# EAGLE design EEPROM_Programmer (EAGLE 9.5.2)
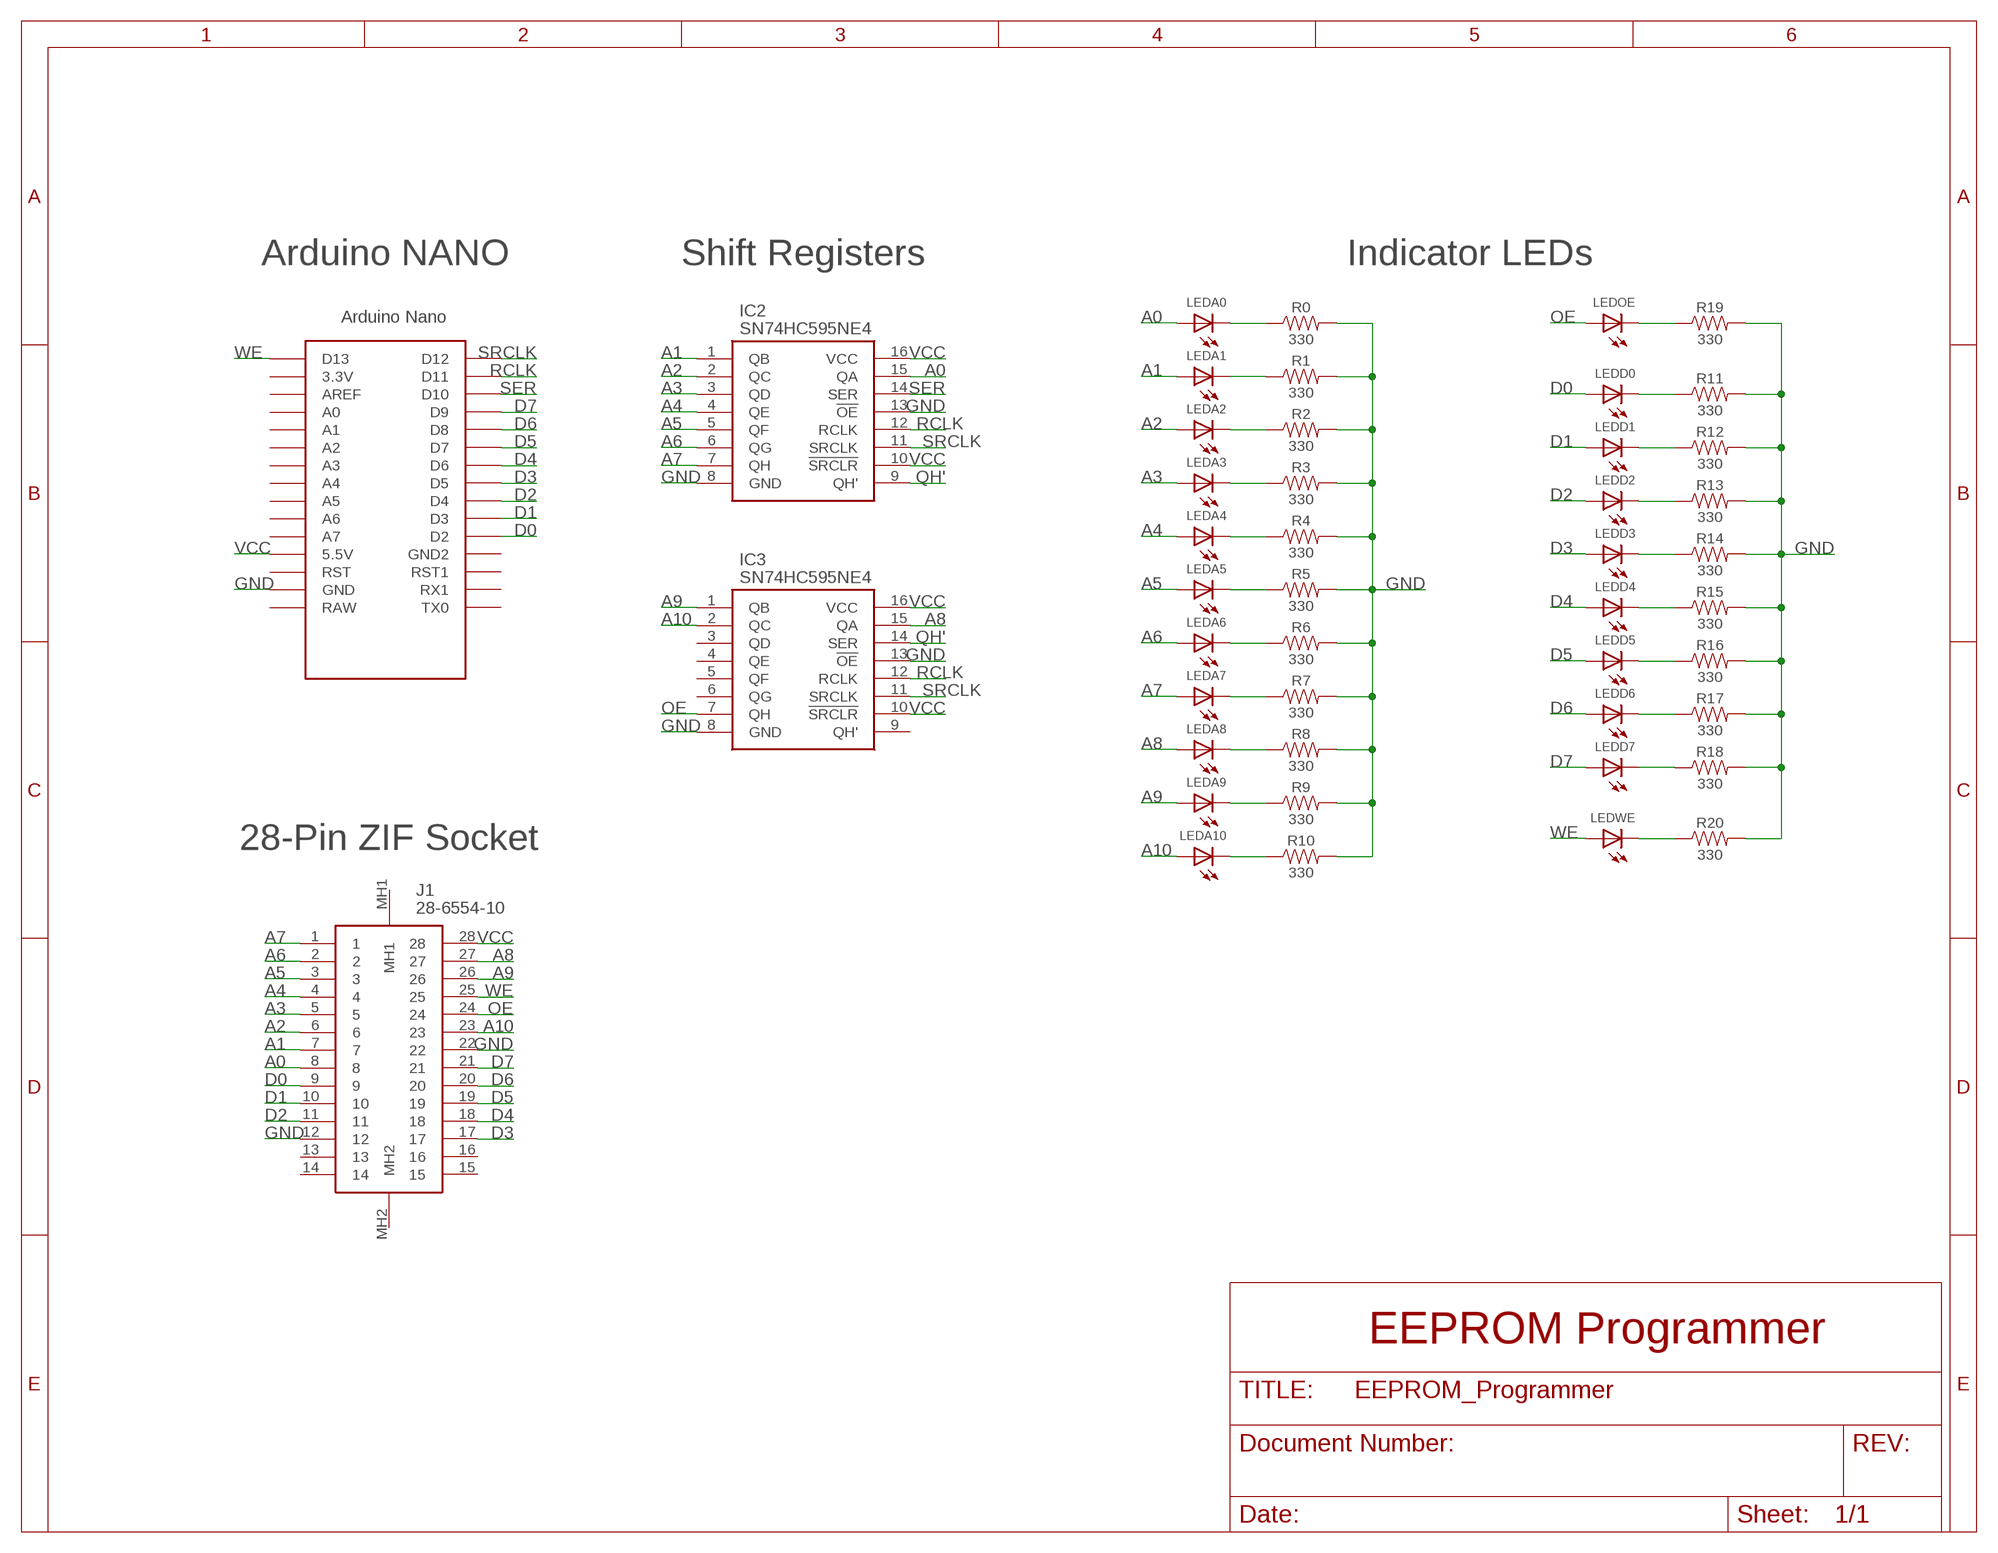
[diagram p0: schematic, sheet 1]

## Parts
IC2  SN74HC595NE4  [DIP794W53P254L1930H508Q16N]
IC3  SN74HC595NE4  [DIP794W53P254L1930H508Q16N]
J1  28-6554-10  [28655410]
LEDA0  LEDCHIPLED_1206  [CHIPLED_1206]
LEDA1  LEDCHIPLED_1206  [CHIPLED_1206]
LEDA2  LEDCHIPLED_1206  [CHIPLED_1206]
LEDA3  LEDCHIPLED_1206  [CHIPLED_1206]
LEDA4  LEDCHIPLED_1206  [CHIPLED_1206]
LEDA5  LEDCHIPLED_1206  [CHIPLED_1206]
LEDA6  LEDCHIPLED_1206  [CHIPLED_1206]
LEDA7  LEDCHIPLED_1206  [CHIPLED_1206]
LEDA8  LEDCHIPLED_1206  [CHIPLED_1206]
LEDA9  LEDCHIPLED_1206  [CHIPLED_1206]
LEDA10  LEDCHIPLED_1206  [CHIPLED_1206]
LEDD0  LEDCHIPLED_1206  [CHIPLED_1206]
LEDD1  LEDCHIPLED_1206  [CHIPLED_1206]
LEDD2  LEDCHIPLED_1206  [CHIPLED_1206]
LEDD3  LEDCHIPLED_1206  [CHIPLED_1206]
LEDD4  LEDCHIPLED_1206  [CHIPLED_1206]
LEDD5  LEDCHIPLED_1206  [CHIPLED_1206]
LEDD6  LEDCHIPLED_1206  [CHIPLED_1206]
LEDD7  LEDCHIPLED_1206  [CHIPLED_1206]
LEDOE  LEDCHIPLED_1206  [CHIPLED_1206]
LEDWE  LEDCHIPLED_1206  [CHIPLED_1206]
R0  330  RESISTOR1206  [1206]
R1  330  RESISTOR1206  [1206]
R2  330  RESISTOR1206  [1206]
R3  330  RESISTOR1206  [1206]
R4  330  RESISTOR1206  [1206]
R5  330  RESISTOR1206  [1206]
R6  330  RESISTOR1206  [1206]
R7  330  RESISTOR1206  [1206]
R8  330  RESISTOR1206  [1206]
R9  330  RESISTOR1206  [1206]
R10  330  RESISTOR1206  [1206]
R11  330  RESISTOR1206  [1206]
R12  330  RESISTOR1206  [1206]
R13  330  RESISTOR1206  [1206]
R14  330  RESISTOR1206  [1206]
R15  330  RESISTOR1206  [1206]
R16  330  RESISTOR1206  [1206]
R17  330  RESISTOR1206  [1206]
R18  330  RESISTOR1206  [1206]
R19  330  RESISTOR1206  [1206]
R20  330  RESISTOR1206  [1206]
U$1  NANO  [NANO]

## Nets
A0: IC2.15(QA) J1.8 LEDA0.A
A1: IC2.1(QB) J1.7 LEDA1.A
A2: IC2.2(QC) J1.6 LEDA2.A
A3: IC2.3(QD) J1.5 LEDA3.A
A4: IC2.4(QE) J1.4 LEDA4.A
A5: IC2.5(QF) J1.3 LEDA5.A
A6: IC2.6(QG) J1.2 LEDA6.A
A7: IC2.7(QH) J1.1 LEDA7.A
A8: IC3.15(QA) J1.27 LEDA8.A
A9: IC3.1(QB) J1.26 LEDA9.A
A10: IC3.2(QC) J1.23 LEDA10.A
D0: J1.9 LEDD0.A U$1.D2
D1: J1.10 LEDD1.A U$1.D3
D2: J1.11 LEDD2.A U$1.D4
D3: J1.17 LEDD3.A U$1.D5
D4: J1.18 LEDD4.A U$1.D6
D5: J1.19 LEDD5.A U$1.D7
D6: J1.20 LEDD6.A U$1.D8
D7: J1.21 LEDD7.A U$1.D9
GND: IC2.8(GND) IC2.13(!OE) IC3.8(GND) IC3.13(!OE) J1.12 J1.22 R0.2 R1.2 R2.2 R3.2 R4.2 R5.2 R6.2 R7.2 R8.2 R9.2 R10.2 R11.2 R12.2 R13.2 R14.2 R15.2 R16.2 R17.2 R18.2 R19.2 R20.2 U$1.GND
N$1: LEDA0.C R0.1
N$2: LEDA2.C R2.1
N$3: LEDA3.C R3.1
N$4: LEDA4.C R4.1
N$5: LEDA5.C R5.1
N$6: LEDA6.C R6.1
N$7: LEDA7.C R7.1
N$8: LEDA8.C R8.1
N$9: LEDA9.C R9.1
N$10: LEDA10.C R10.1
N$11: LEDA1.C R1.1
N$12: LEDD0.C R11.1
N$13: LEDD1.C R12.1
N$14: LEDD2.C R13.1
N$15: LEDD3.C R14.1
N$16: LEDD4.C R15.1
N$17: LEDD5.C R16.1
N$18: LEDD6.C R17.1
N$19: LEDD7.C R18.1
N$20: LEDOE.C R19.1
N$21: LEDWE.C R20.1
OE: IC3.7(QH) J1.24 LEDOE.A
QH': IC2.9(QH') IC3.14(SER)
RCLK: IC2.12(RCLK) IC3.12(RCLK) U$1.D11
SER: IC2.14(SER) U$1.D10
SRCLK: IC2.11(SRCLK) IC3.11(SRCLK) U$1.D12
VCC: IC2.10(!SRCLR) IC2.16(VCC) IC3.10(!SRCLR) IC3.16(VCC) J1.28 U$1.5V(5.5V)
WE: J1.25 LEDWE.A U$1.D13
Unconnected: IC3.3(QD) IC3.4(QE) IC3.5(QF) IC3.6(QG) IC3.9(QH') J1.13 J1.14 J1.15 J1.16 J1.MH1 J1.MH2 U$1.3.3V U$1.A0 U$1.A1 U$1.A2 U$1.A3 U$1.A4 U$1.A5 U$1.A6 U$1.A7 U$1.AREF U$1.GND1(GND2) U$1.RAW U$1.RST U$1.RST1 U$1.RX1 U$1.TX0

## Notes on the sheet
- Arduino NANO | Shift Registers | Indicator LEDs
- 28-Pin ZIF Socket

## Library data of the parts
IC2 IC3 = !EEPROM_Programmer:SN74HC595NE4: Counter Shift Registers 8-Bit Shift Register Source: Datasheet <http://www.ti.com/lit/ds/symlink/sn74hc595.pdf>; DESCRIPTION: Counter Shift Registers 8-Bit Shift Register; HEIGHT: 5.08mm; MANUFACTURER_NAME: Texas Instruments; MANUFACTURER_PART_NUMBER: SN74HC595NE4; MOUSER_PART_NUMBER: 595-SN74HC595NE4; MOUSER_PRICE-STOCK: https://www.mouser.com/Search/Refine.aspx?Keyword=595-SN74HC595NE4
J1 = !EEPROM_Programmer:28-6554-10: Aries Electronics 2.54mm Pitch 28 Way Through Hole Universal ZIF Test Socket Source: Datasheet <https://componentsearchengine.com/Datasheets/1/28-6554-10.pdf>; DESCRIPTION: Aries Electronics 2.54mm Pitch 28 Way Through Hole Universal ZIF Test Socket; HEIGHT: 11.94mm; MANUFACTURER_NAME: ARIES; MANUFACTURER_PART_NUMBER: 28-6554-10; MOUSER_PART_NUMBER: 535-28-6554-10; MOUSER_PRICE-STOCK: https://www.mouser.com/Search/Refine.aspx?Keyword=535-28-6554-10; RS_PART_NUMBER: 0403825; RS_PRICE-STOCK: http://uk.rs-online.com/web/p/products/0403825
LEDA0 LEDA1-LEDA10 LEDD0 LEDD1-LEDD7 LEDOE LEDWE = adafruit:LED: LED OSRAM: - CHIPLED LG R971, LG N971, LY N971, LG Q971, LY Q971, LO R971, LY R971 LH N974, LH R974 LS Q976, LO Q976, LY Q976 LO Q996 - Hyper CHIPLED LW Q18S LB Q993, LB Q99A, LB R99A - SideLED LS A670, LO A670, LY A670, LG A670, LP A670 LB A673, LV A673, LT A673, LW A673 LH A674 LY A675 LS A676, LA A676, LO A676, LY A676, LW A676 LS A679, LY A679, LG A679 - Hyper Micro SIDELED® LS Y876, LA Y876, LO Y876, LY Y876 LT Y87S - SmartLED LW L88C, LW L88S LB L89C, LB L89S, LG L890 LS L89K, LO L89K, LY L89K LS L896, LA L896, LO L896, LY L896 - TOPLED LS T670, LO T670, LY T670, LG T670, LP T670 LSG T670, LSP T670, LSY T670, LOP T670, LYG T670 LG T671, LOG T671, LSG T671 LB T673, LV T673, LT T673, LW T673 LH T674 LS T676, LA T676, LO T676, LY T676, LB T676, LH T676, LSB T676, LW T676 LB T67C, LV T67C, LT T67C, LS T67K, LO T67K, LY T67K, LW E67C LS E67B, LA E67B, LO E67B, LY E67B, LB E67C, LV E67C, LT E67C LW T67C LS T679, LY T679, LG T679 LS T770, LO T770, LY T770, LG T770, LP T770 LB T773, LV T773, LT T773, LW T773 LH T774 LS E675, LA E675, LY E675, LS T675 LS T776, LA T776, LO T776, LY T776, LB T776 LHGB T686 LT T68C, LB T68C - Hyper Mini TOPLED® LB M676 - Mini TOPLED Santana® LG M470 LS M47K, LO M47K, LY M47K Source: http://www.osram.convergy.de/
R0 R1-R20 = SparkFun-Resistors:RESISTOR: Generic Resistor Package
U$1 = !EEPROM_Programmer:NANO: Arduino Nano

## Board
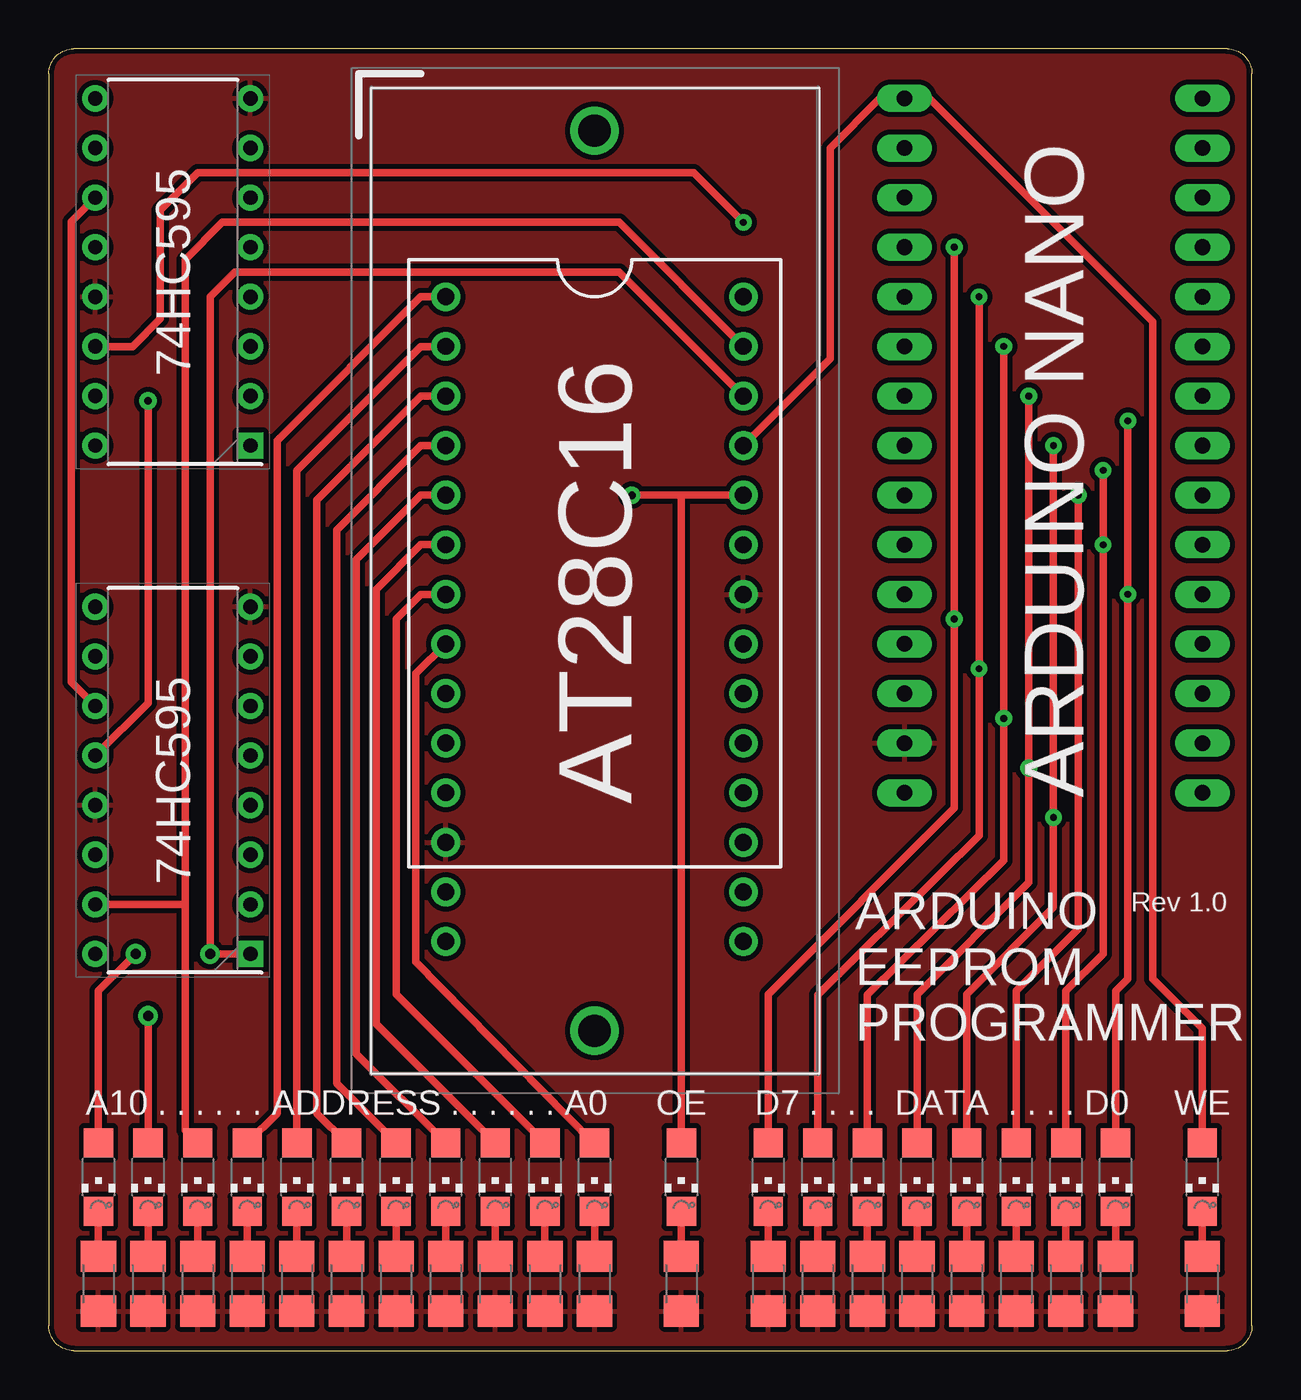
[diagram p1: board, top side]
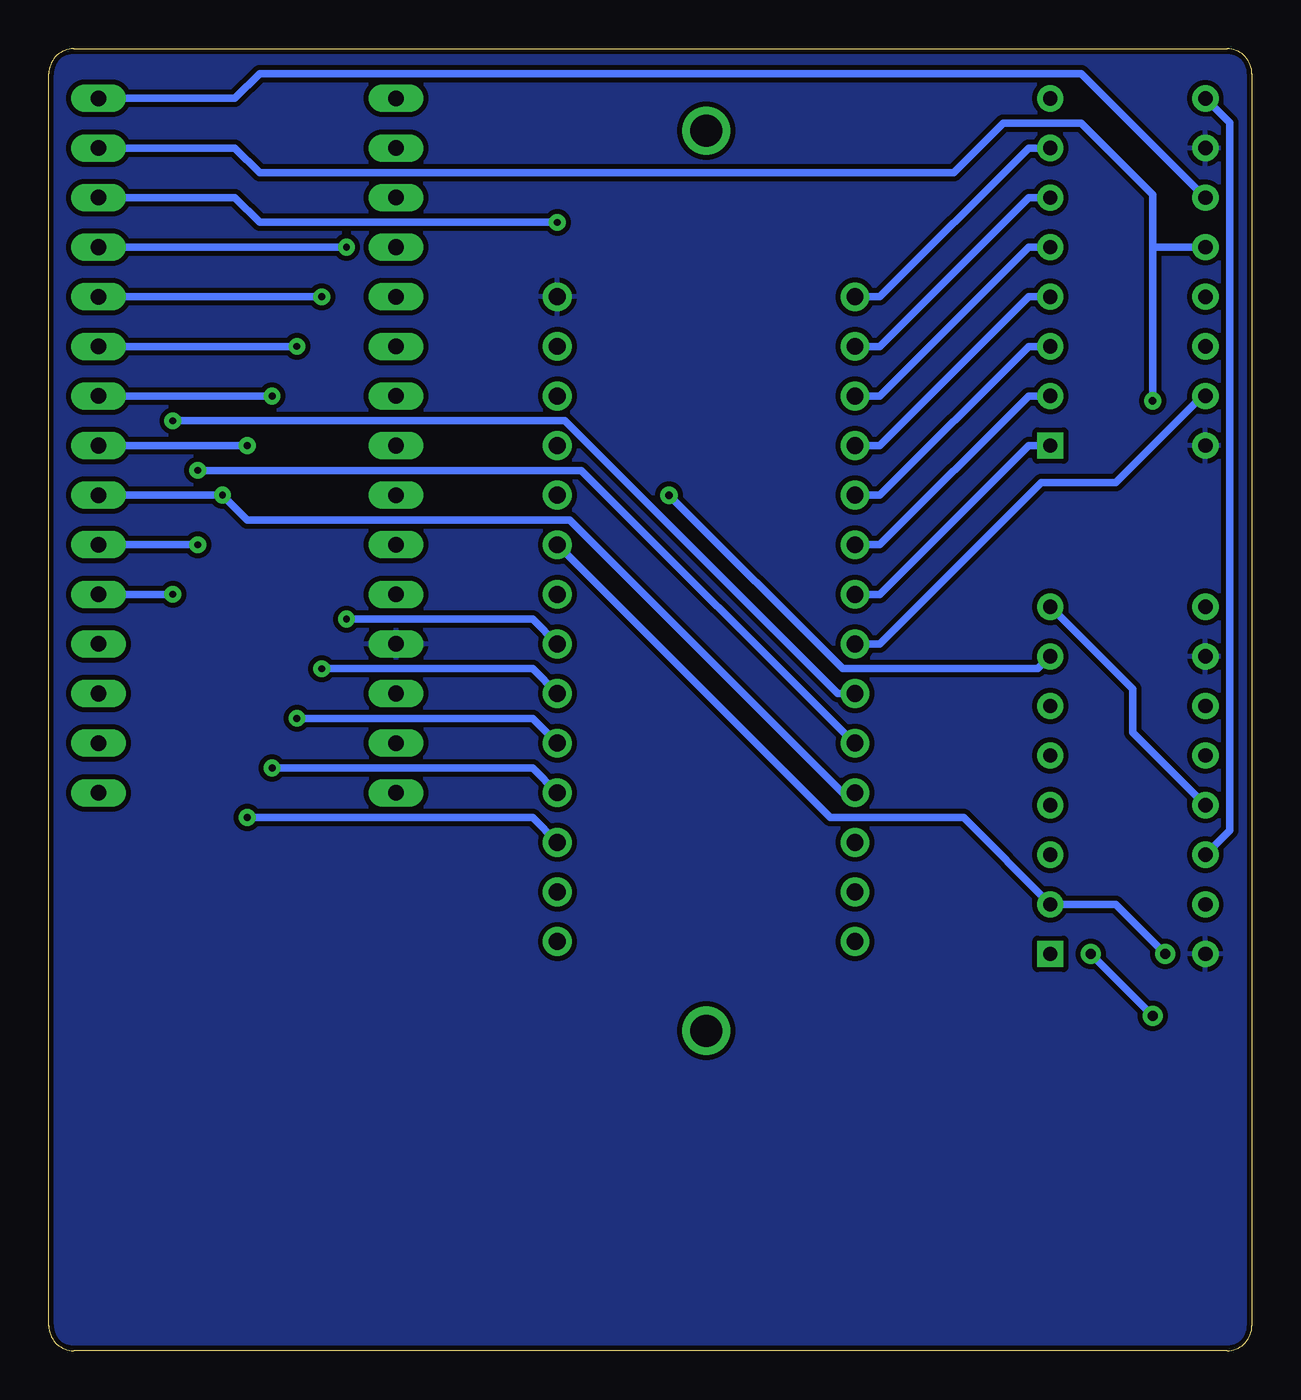
[diagram p2: board, bottom side, seen from below]

Size 61.59 x 66.67 mm. Coordinates in mm from the lower left corner, seen from the top.
Outline: 60.33,66.67 1.27,66.67 arc90 0,65.41 0,1.27 arc90 1.27,0 60.33,0 arc90 61.59,1.27 61.59,65.41 arc90 60.33,66.67
Copper layers (1*16): Top 0.035mm / dielectric 1.5mm / Bottom 0.035mm
Design rules "SparkFun": minimum track width 8mil, minimum drill 10mil, track to track 8mil, track to pad 8mil, pad to pad 8mil, via to via 8mil, smd to smd 8mil, copper to edge 8mil, drill to drill 8mil, minimum pad ring 12mil, minimum via ring 10mil, stop-mask expansion 4mil, vias tented up to drill 20mil, thermal gap 10mil

### Footprints (pad centres in the part's own frame; a part is rotated, then mirrored left to right if it is on the bottom)
DIP794W53P254L1930H508Q16N = drill 0.73 pad 1.13 square: 1 -3.97,8.89 | drill 0.73 pad 1.13: 2 -3.97,6.35; 3 -3.97,3.81; 4 -3.97,1.27; 5 -3.97,-1.27; 6 -3.97,-3.81; 7 -3.97,-6.35; 8 -3.97,-8.89; 9 3.97,-8.89; 10 3.97,-6.35; 11 3.97,-3.81; 12 3.97,-1.27; 13 3.97,1.27; 14 3.97,3.81; 15 3.97,6.35; 16 3.97,8.89
28655410 = drill 0.864 pad 1.404: 1 0,0; 2 2.54,0; 3 5.08,0; 4 7.62,0; 5 10.16,0; 6 12.7,0; 7 15.24,0; 8 17.78,0; 9 20.32,0; 10 22.86,0; 11 25.4,0; 12 27.94,0; 13 30.48,0; 14 33.02,0; 15 33.02,15.24; 16 30.48,15.24; 17 27.94,15.24; 18 25.4,15.24; 19 22.86,15.24; 20 20.32,15.24; 21 17.78,15.24; 22 15.24,15.24; 23 12.7,15.24; 24 10.16,15.24; 25 7.62,15.24; 26 5.08,15.24; 27 2.54,15.24; 28 0,15.24 | drill 1.65 pad 2.475: MH1 -8.51,7.62; MH2 37.59,7.62
CHIPLED_1206 = smd 1.5 x 1.5: A 0,-1.75; C 0,1.75
1206 = smd 1.6 x 1.8: 1 -1.4,0; 2 1.4,0
NANO = drill 0.8 long: 3.3V -10.16,24.13; 5V -10.16,-1.27; A0 -10.16,19.05; A1 -10.16,16.51; A2 -10.16,13.97; A3 -10.16,11.43; A4 -10.16,8.89; A5 -10.16,6.35; A6 -10.16,3.81; A7 -10.16,1.27; AREF -10.16,21.59; D2 5.08,1.27; D3 5.08,3.81; D4 5.08,6.35; D5 5.08,8.89; D6 5.08,11.43; D7 5.08,13.97; D8 5.08,16.51; D9 5.08,19.05; D10 5.08,21.59; D11 5.08,24.13; D12 5.08,26.67; D13 -10.16,26.67; GND -10.16,-6.35; GND1 5.08,-1.27; RAW -10.16,-8.89; RST -10.16,-3.81; RST1 5.08,-3.81; RX1 5.08,-6.35; TX0 5.08,-8.89

### Placement (x,y rotation side)
IC2  6.35,55.24 180 top
IC3  6.35,29.21 180 top
J1  20.32,53.98 270 top
LEDA0  27.94,8.89 180 top
LEDA1  25.4,8.89 180 top
LEDA2  22.86,8.89 180 top
LEDA3  20.32,8.89 180 top
LEDA4  17.78,8.89 180 top
LEDA5  15.24,8.89 180 top
LEDA6  12.7,8.89 180 top
LEDA7  10.16,8.89 180 top
LEDA8  7.62,8.89 180 top
LEDA9  5.08,8.89 180 top
LEDA10  2.54,8.89 180 top
LEDD0  54.61,8.89 180 top
LEDD1  52.07,8.89 180 top
LEDD2  49.53,8.89 180 top
LEDD3  46.99,8.89 180 top
LEDD4  44.45,8.89 180 top
LEDD5  41.91,8.89 180 top
LEDD6  39.37,8.89 180 top
LEDD7  36.83,8.89 180 top
LEDOE  32.38,8.89 180 top
LEDWE  59.05,8.89 180 top
R0  27.94,3.43 270 top
R1  25.4,3.43 270 top
R2  22.86,3.43 270 top
R3  20.32,3.43 270 top
R4  17.78,3.43 270 top
R5  15.24,3.43 270 top
R6  12.7,3.43 270 top
R7  10.16,3.43 270 top
R8  7.62,3.43 270 top
R9  5.08,3.43 270 top
R10  2.54,3.43 270 top
R11  54.61,3.43 270 top
R12  52.07,3.43 270 top
R13  49.53,3.43 270 top
R14  46.99,3.43 270 top
R15  44.45,3.43 270 top
R16  41.91,3.43 270 top
R17  39.37,3.43 270 top
R18  36.83,3.43 270 top
R19  32.38,3.43 270 top
R20  59.05,3.43 270 top
U$1  53.98,37.47 0 top

### Tracks (layer width: path | path; a pad name or v marks a point on that pad's centre or on a via)
A0
  Top 0.381: LEDA0.A 27.87,10.64 18.8,19.91 18.8,34.67 J1.8
  Bottom 0.381: J1.8 19.05,36.2 10.79,44.45 6.99,44.45 2.54,48.9 IC2.15
A1
  Top 0.381: LEDA1.A 17.78,18.26 17.78,37.47 19.05,38.73 J1.7
  Bottom 0.381: IC2.1 11.43,46.35 19.05,38.73 J1.7
A2
  Top 0.381: J1.6 19.05,41.27 16.76,38.99 16.76,16.74 LEDA2.A
  Bottom 0.381: IC2.2 11.43,48.9 19.05,41.27 J1.6
A3
  Top 0.381: J1.5 19.05,43.81 15.75,40.51 15.75,15.21 LEDA3.A
  Bottom 0.381: IC2.3 11.43,51.44 19.05,43.81 J1.5
A4
  Top 0.381: J1.4 19.05,46.35 14.73,42.04 14.73,13.69 LEDA4.A
  Bottom 0.381: IC2.4 11.43,53.98 19.05,46.35 J1.4
A5
  Top 0.381: J1.3 19.05,48.9 13.72,43.56 13.72,12.16 LEDA5.A
  Bottom 0.381: IC2.5 11.43,56.52 19.05,48.9 J1.3
A6
  Top 0.381: LEDA6.A 12.7,45.09 19.05,51.44 J1.2
  Bottom 0.381: IC2.6 11.43,59.05 19.05,51.44 J1.2
A7
  Top 0.381: J1.1 19.05,53.98 11.68,46.61 11.68,12.16 LEDA7.A
  Bottom 0.381: J1.1 19.05,53.98 11.43,61.59 IC2.7
A8
  Top 0.381: LEDA8.A 6.99,11.28 6.99,22.86 | 6.99,22.86 6.99,55.88 8.89,57.78 29.21,57.78 J1.27 | IC3.15 6.99,22.86
A9  (via drill 0.51)
  Top 0.381: J1.26 29.21,55.24 9.53,55.24 8.26,53.98 v8.26,20.32 IC3.1 | v5.08,17.14 LEDA9.A
  Bottom 0.381: v8.26,20.32 v5.08,17.14
A10  (via drill 0.51)
  Top 0.381: v4.45,20.32 2.54,18.41 LEDA10.A
  Bottom 0.381: J1.23 21.59,27.3 14.77,27.3 IC3.2 6.99,22.86 v4.45,20.32
D0  (via drill 0.35)
  Top 0.381: LEDD0.A 54.61,18.41 55.24,19.05 v55.24,38.73 v55.24,47.62
  Bottom 0.381: J1.9 21.21,33.66 35.18,47.62 v55.24,47.62 | U$1.D2 v55.24,38.73
D1  (via drill 0.35)
  Top 0.381: LEDD1.A 52.07,18.41 53.98,20.32 v53.98,41.27 v53.98,45.09
  Bottom 0.381: J1.10 20.37,31.11 34.34,45.09 v53.98,45.09 | U$1.D3 v53.98,41.27
D2  (via drill 0.35)
  Top 0.381: LEDD2.A 49.53,18.41 52.7,21.59 v52.7,43.81
  Bottom 0.381: J1.11 20.95,28.57 34.92,42.55 51.44,42.55 v52.7,43.81 U$1.D4
D3  (via drill 0.35)
  Top 0.381: LEDD3.A 46.99,18.26 51.44,22.7 v51.44,27.3 v51.44,46.35
  Bottom 0.381: J1.17 36.83,27.3 v51.44,27.3 | v51.44,46.35 U$1.D5
D4  (via drill 0.35)
  Top 0.381: LEDD4.A 44.45,18.26 50.16,23.98 v50.16,29.84 v50.16,48.9
  Bottom 0.381: J1.18 36.83,29.84 v50.16,29.84 | v50.16,48.9 U$1.D6
D5  (via drill 0.35)
  Top 0.381: LEDD5.A 41.91,18.21 48.9,25.12 v48.9,32.38 v48.9,51.44
  Bottom 0.381: J1.19 36.83,32.38 v48.9,32.38 | v48.9,51.44 U$1.D7
D6  (via drill 0.35)
  Top 0.381: LEDD6.A 39.37,18.22 47.62,26.39 v47.62,34.92 v47.62,53.98
  Bottom 0.381: J1.20 36.83,34.92 v47.62,34.92 | v47.62,53.98 U$1.D8
D7  (via drill 0.35)
  Top 0.381: LEDD7.A 36.83,18.26 46.35,27.79 v46.35,37.47 v46.35,56.52
  Bottom 0.381: J1.21 36.83,37.47 v46.35,37.47 | U$1.D9 v46.35,56.52
GND
  Bottom 0.381: IC3.8 6.1,33.88 6.1,31.66 IC3.13
  pour Top (isolate 0.254): 61.59,66.67 0,66.67 0,0 61.59,0
N$1
  Top 0.381: LEDA0.C R0.1
N$2
  Top 0.381: LEDA2.C R2.1
N$3
  Top 0.381: LEDA3.C R3.1
N$4
  Top 0.381: LEDA4.C R4.1
N$5
  Top 0.381: LEDA5.C R5.1
N$6
  Top 0.381: LEDA6.C R6.1
N$7
  Top 0.381: LEDA7.C R7.1
N$8
  Top 0.381: LEDA8.C R8.1
N$9
  Top 0.381: LEDA9.C R9.1
N$10
  Top 0.381: LEDA10.C R10.1
N$11
  Top 0.381: LEDA1.C R1.1
N$12
  Top 0.381: LEDD0.C R11.1
N$13
  Top 0.381: LEDD1.C R12.1
N$14
  Top 0.381: LEDD2.C R13.1
N$15
  Top 0.381: LEDD3.C R14.1
N$16
  Top 0.381: LEDD4.C R15.1
N$17
  Top 0.381: LEDD5.C R16.1
N$18
  Top 0.381: LEDD6.C R17.1
N$19
  Top 0.381: LEDD7.C R18.1
N$20
  Top 0.381: LEDOE.C R19.1
N$21
  Top 0.381: LEDWE.C R20.1
OE  (via drill 0.38)
  Top 0.381: v29.84,43.81 32.38,43.81 | 32.38,43.81 LEDOE.A | J1.24 32.38,43.81
  Bottom 0.381: IC3.7 10.96,34.92 20.95,34.92 v29.84,43.81
QH'
  Bottom 0.381: IC2.9 1.14,62.9 1.14,26.64 IC3.14
RCLK  (via drill 0.38)
  Top 0.381: v5.08,48.64 5.08,33.18 IC3.12
  Bottom 0.381: v5.08,48.64 5.08,56.52 | 5.08,56.52 5.08,59.22 8.73,62.87 12.72,62.87 15.26,60.33 50.8,60.33 52.07,61.59 U$1.D11 | IC2.12 5.08,56.52
SER  (via drill 0.35)
  Top 0.381: IC2.14 4.29,51.44 5.71,52.87 5.71,58.42 7.62,60.33 33.02,60.33 v35.56,57.78
  Bottom 0.381: v35.56,57.78 50.8,57.78 52.07,59.05 U$1.D10
SRCLK
  Top 0.381: IC2.11 1.14,57.82 1.14,34.26 IC3.11
  Bottom 0.381: IC2.11 8.73,65.41 50.8,65.41 52.07,64.14 U$1.D12
VCC
  pour Bottom (isolate 0.254): 61.59,66.67 61.59,0 0,0 0,66.67
WE
  Top 0.381: J1.25 40.01,50.8 40.01,61.59 42.55,64.14 U$1.D13 45.09,64.14 56.52,52.7 56.52,19.05 59.05,16.51 LEDWE.A

### Text on the board
tPlace: 74HC595 | ARDUINO NANO | AT28C16 | 74HC595 | Rev 1.0 | ARDUINO / EEPROM / PROGRAMMER | A10 . . . . . . ADDRESS . . . . . . A0 | OE | D7 . . . . DATA . . . . D0 | WE